# EasyEDA schematic SCH_homework2_2025-05-07.json
TITLE: Sheet_3; REV: 1.0; Date: 2025-04-25; Sheet: 1/1; Drawn By: iperov.55; Company: Your Company
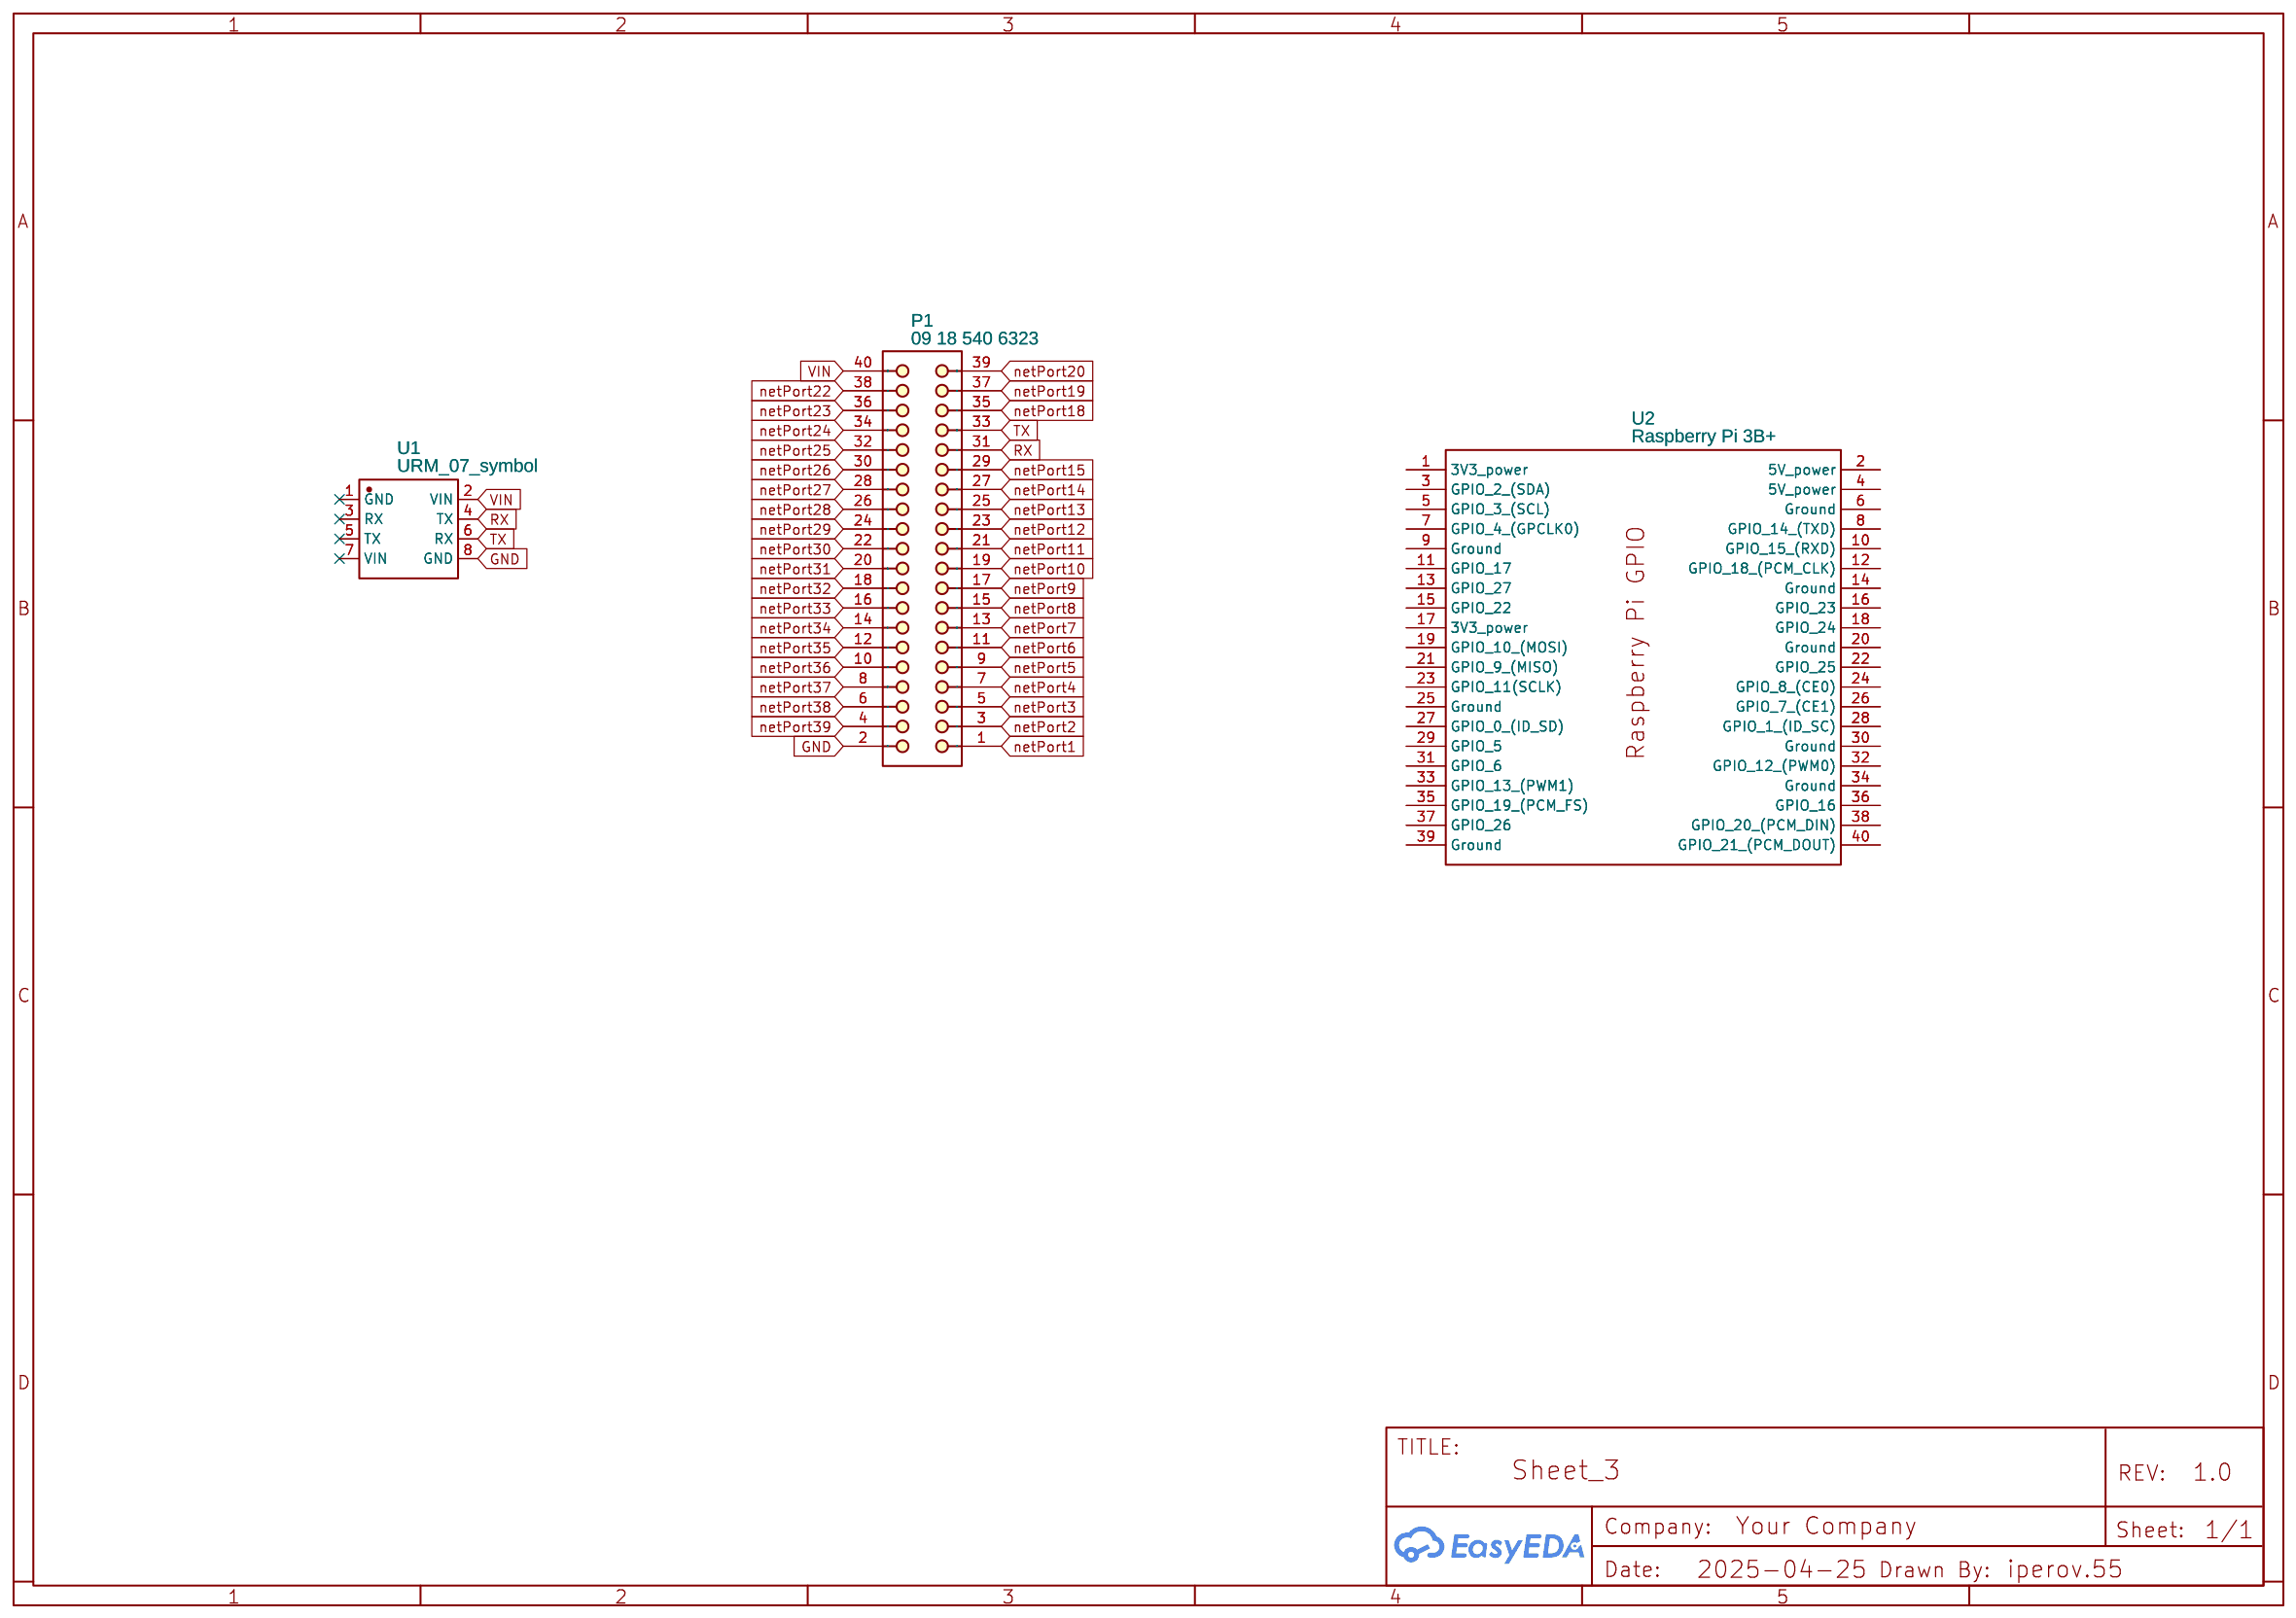
[diagram p0: schematic sheet]

## Parts
P1  09 18 540 6323  [918540X323]
U1  URM_07_symbol  [URM07]
U2  Raspberry Pi 3B+  [RASPBERRYPI3B+]

## Library data of the parts
P1 = 09 18 540 6323: Flat Cable Connector (IDC), Low-Profile Male Header, Angled Solder Pin, 40 Contacts, Performance Level 2
U1 = URM_07_symbol: Contributor: iperov.55
U2 = Raspberry Pi 3B+: Contributor: barkster

## Nets
GND: P1.2 U1.8(GND)
VIN: P1.40 U1.2(VIN)
netPort1: P1.1
netPort2: P1.3
netPort3: P1.5
netPort4: P1.7
netPort5: P1.9
netPort6: P1.11
netPort7: P1.13
netPort8: P1.15
netPort9: P1.17
netPort10: P1.19
netPort11: P1.21
netPort12: P1.23
netPort13: P1.25
netPort14: P1.27
netPort15: P1.29
netPort18: P1.35
netPort19: P1.37
netPort20: P1.39
netPort22: P1.38
netPort23: P1.36
netPort24: P1.34
netPort25: P1.32
netPort26: P1.30
netPort27: P1.28
netPort28: P1.26
netPort29: P1.24
netPort30: P1.22
netPort31: P1.20
netPort32: P1.18
netPort33: P1.16
netPort34: P1.14
netPort35: P1.12
netPort36: P1.10
netPort37: P1.8
netPort38: P1.6
netPort39: P1.4
RX: P1.31 U1.4(TX)
TX: P1.33 U1.6(RX)

Not connected (* = marked no-connect by the designer): U1 1(GND)* 3(RX)* 5(TX)* 7(VIN)*; U2 1(3V3 power) 2(5V power) 3(GPIO 2 (SDA)) 4(5V power) 5(GPIO 3 (SCL)) 6(Ground) 7(GPIO 4 (GPCLK0)) 8(GPIO 14 (TXD)) 9(Ground) 10(GPIO 15 (RXD)) 11(GPIO 17) 12(GPIO 18 (PCM_CLK)) 13(GPIO 27) 14(Ground) 15(GPIO 22) 16(GPIO 23) 17(3V3 power) 18(GPIO 24) 19(GPIO 10 (MOSI)) 20(Ground) 21(GPIO 9 (MISO)) 22(GPIO 25) 23(GPIO 11(SCLK)) 24(GPIO 8 (CE0)) 25(Ground) 26(GPIO 7 (CE1)) 27(GPIO 0 (ID_SD)) 28(GPIO 1 (ID_SC)) 29(GPIO 5) 30(Ground) 31(GPIO 6) 32(GPIO 12 (PWM0)) 33(GPIO 13 (PWM1)) 34(Ground) 35(GPIO 19 (PCM_FS)) 36(GPIO 16) 37(GPIO 26) 38(GPIO 20 (PCM_DIN)) 39(Ground) 40(GPIO 21 (PCM_DOUT))
